# Altium schematic sheet SSR.SchDoc: Solid State Relay
size A4; DocumentNumber: 6; SheetNumber: 5; SheetTotal: 9
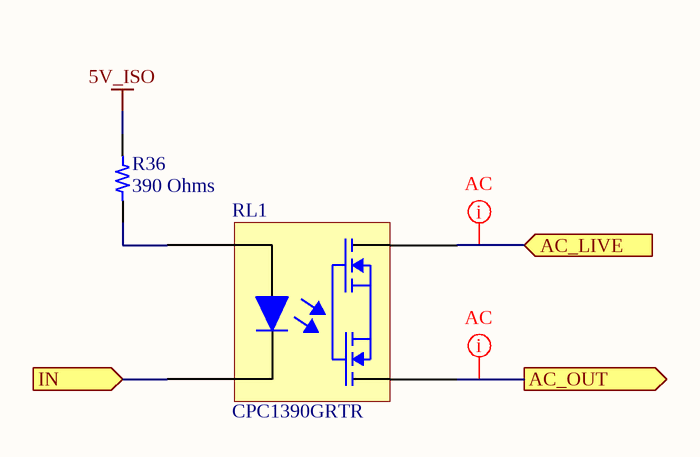
[diagram p0: SSR.SchDoc]

## Parts
R36  390 Ohms  [RES 0603_1608]
RL1  CPC1390GRTR  [IXYS SOP-4 CPC1390GR]

## Ports
AC_LIVE (in, see SSR_switch[3D], AC current measurement[3B], SSR_switch[3D]), AC_OUT (out, see SSR_switch[4D]), IN (in, see SSR_switch[3D])

## Nets
5V_ISO: R36.2
AC_LIVE: RL1.4 ; port AC_LIVE
AC_OUT: RL1.3 ; port AC_OUT
IN: RL1.2 ; port IN
NetR36_1: R36.1 RL1.1

## Layout directives
net class AC: AC_LIVE, AC_OUT

## Notes on the sheet
- Title
- Size:
- Date:
- A4
- Number:
- Time:
- Revision:
- Sheet
- of
- File:

## Library data of the parts
R36 = CRCW0603390RFKEAC: RES 390 OHM 1% 1/10W 0603; Manufacturer: Vishay Dale; Power (Watts): 0.1W, 1/10W; Temperature Coefficient: ±100ppm/°C; Part Number: CRCW0603390RFKEAC; Value: 390 Ohms; ComponentLink1Description: Datasheet; ComponentLink1URL: https://www.vishay.com/docs/28773/crcwce3.pdf; ComponentLink2Description: DigiKey Link; ComponentLink2URL: https://www.digikey.com/en/products/detail/vishay-dale/CRCW0603390RFKEAC/7924125; Composition: Thick Film; Device Package: 0603 (1608 Metric); Height - Seated (Max): 0.022" (0.55mm); LastUpdated: 6/13/2023 8:12:47 PM; Lifecycle Status: Active; Minimum Order: 1; Number of Terminations: 2; Operating Temperature: -55°C ~ 155°C; Package / Case: 0603 (1608 Metric); Packaging: CutTape; PartId: 65705; Part Status: Active; Price: 0.01; Resistance: 390 Ohms; Series: CRCW-C; Size / Dimension: 0.063" L x 0.031" W (1.60mm x 0.80mm); Supplier 1: DigiKey; Supplier Part Number 1: 541-5380-1-ND; Supplier Device Package: 0603; Tolerance: ±1%
RL1 = CPC1390GRTR: SSR RELAY SPST-NO 140MA 0-400V; Manufacturer: IXYS Integrated Circuits Division; Circuit: SPST-NO (1 Form A); On-State Resistance (Max): 22 Ohms; Output Type: AC, DC; Voltage - Input: 1.2VDC; Voltage - Load: 0 V ~ 400 V; ComponentLink1Description: Datasheet; ComponentLink1URL: http://www.ixysic.com/home/pdfs.nsf/0/9B95EEECA83780688525720B0055EE7F/$file/CPC1390.pdf; ComponentLink2Description: DigiKey Link; ComponentLink2URL: https://www.digikey.com/en/products/detail/ixys-integrated-circuits-division/CPC1390GRTR/1277123; LastUpdated: 6/14/2023 8:30:33 PM; Lifecycle Status: Active; Load Current: 140 mA; Part Number: CPC1390GRTR; Minimum Order: 1; Mounting Type: Surface Mount; Package / Case: 4-SMD (0.300", 7.62mm); Packaging: TapeAndReel; Part Status: Active; Price: 1.09; Series: CPC, OptoMOS®; Supplier 1: DigiKey; Supplier Part Number 1: CLA269CT-ND; Supplier Device Package: 4-SMD; Termination Style: Gull Wing